# EasyEDA Pro project 3轴6.1--esp32 -(0802).eprj, schematic 原理图
Board Name: esp32; Create Date: 2025-05-14; Page Name: 电源; Project Name: 3轴6.1--esp32 -(0802); Schematic Name: 原理图; Update Date: 2025-08-28; Company: 嘉立创EDA; Page Size: A3; Version: V1.0
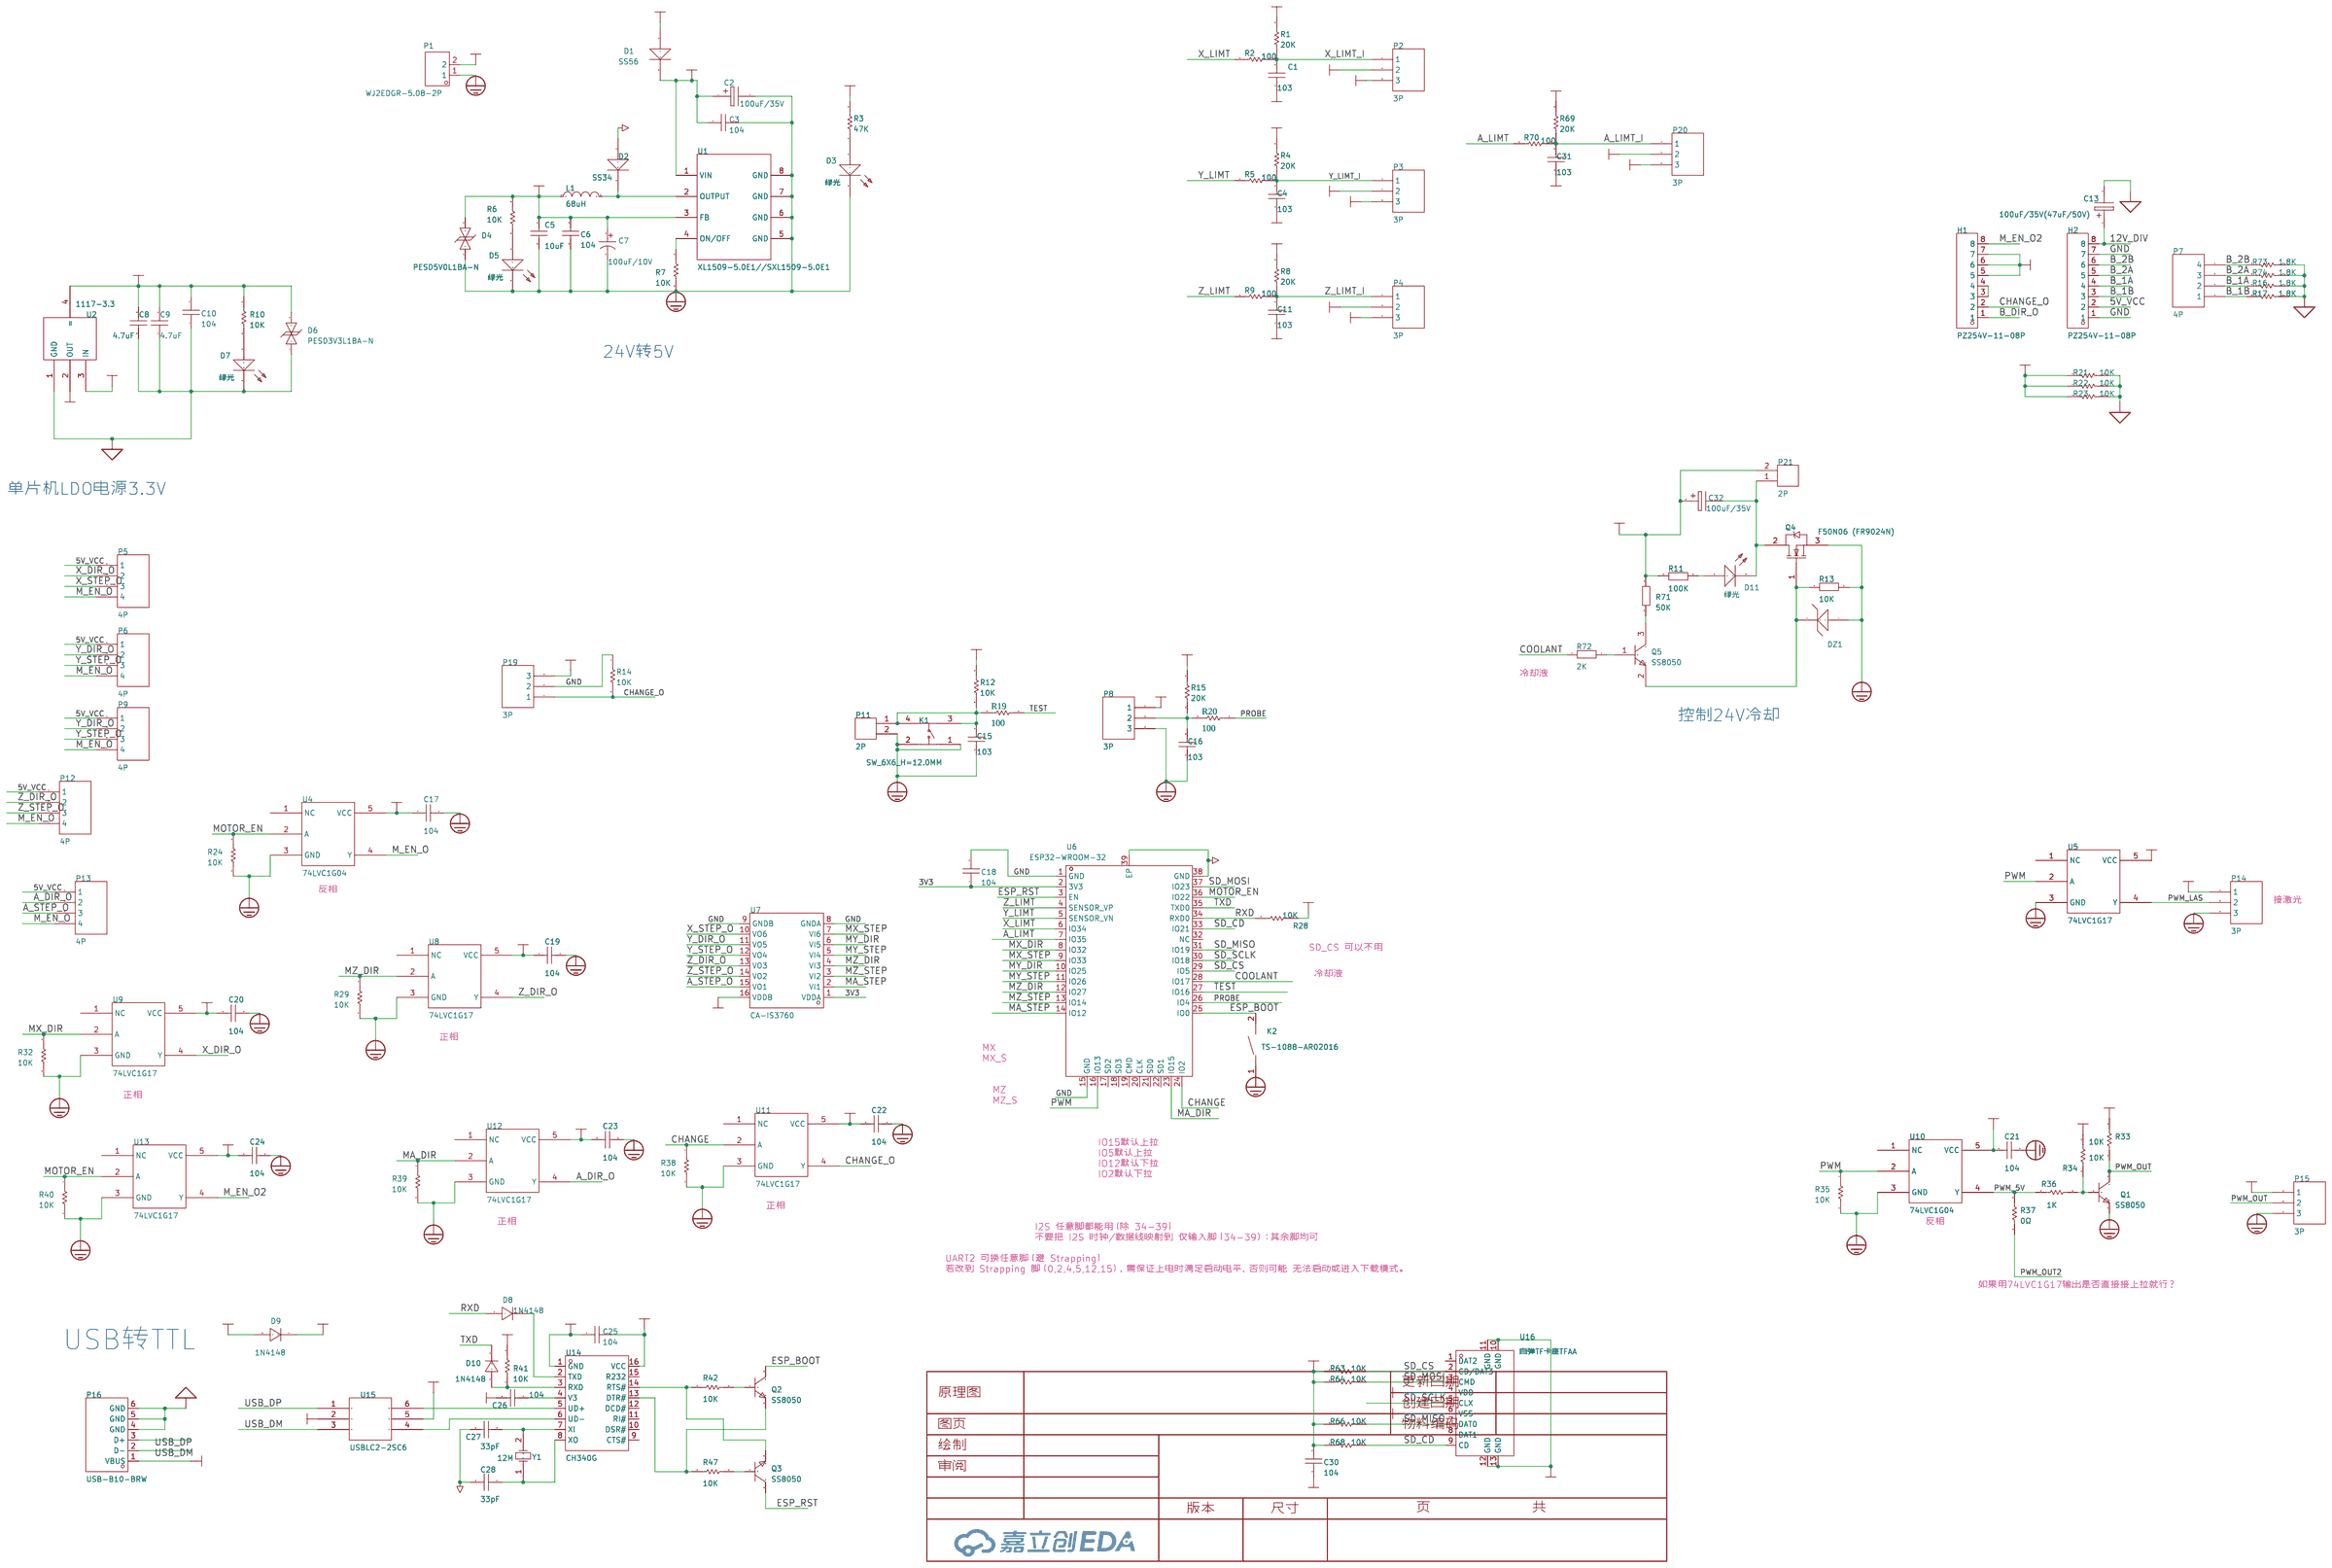
[diagram p0: schematic sheet]

## Parts
C1  103  [11]
C2  100uF/35V  [电解电容贴片6X6]
C3  104  [0603C]
C4  103  [11]
C5  10uF  [C1206]
C6  104  [0603C]
C7  100uF/10V  [CAP-SMD_BD5.0-L5.3-W5.3-RD]
C8  4.7uF  [C1206]
C9  4.7uF  [C1206]
C10  104  [0603C]
C11  103  [11]
C13  100uF/35V(47uF/50V)  [电解电容贴片6X6]
C15  103  [11]
C16  103  [11]
C17  104  [0603C]
C18  104  [0603C]
C19  104  [0603C]
C20  104  [0603C]
C21  104  [0603C]
C22  104  [0603C]
C23  104  [0603C]
C24  104  [0603C]
C25  104  [0603C]
C26  104  [0603C]
C27  18pF  [0603C]
C28  18pF  [0603C]
C30  104  [11]
C31  103  [11]
C32  100uF/35V  [电解电容贴片6X6]
D1  SS56  [SMA]
D2  SS34  [SMA]
D3  绿光  [0603LED]
D4  PESD5V0L1BA-N  [SOD-323_L1.8-W1.3-LS2.5-BI]
D5  绿光  [0603LED]
D6  PESD3V3L1BA-N  [SOD-323_L1.8-W1.3-LS2.5-BI]
D7  绿光  [0603LED]
D8  1N4148  [SOD-123_L2.8-W1.8-LS3.7-RD]
D9  1N4148  [SOD-123_L2.8-W1.8-LS3.7-RD]
D10  1N4148  [SOD-123_L2.8-W1.8-LS3.7-RD]
D11  绿光  [0603LED]
DZ1  --ѹ------SMAZ10V  [SMA]
H1  PZ254V-11-08P  [HDR-TH_8P-P2.54-V-M]
H2  PZ254V-11-08P  [HDR-TH_8P-P2.54-V-M]
K1  SW_6X6_H=12.0MM  [KEY-SMD_4P-L6.0-W6.0-P4.50-LS9.0]
K2  TS-1088-AR02016  [SW-SMD_L3.9-W3.0-P4.45]
L1  68uH  [IND-SMD_L7.0-W7.0_SMDRI74-330MT]
P1  WJ2EDGR-5.08-2P  [CONN-TH_WJ2EDGR-5.08-2P]
P2  3P  [HDR1X3_CON]
P3  3P  [HDR1X3_CON]
P4  3P  [HDR1X3_CON]
P5  4P  [HDR1X4_CON]
P6  4P  [HDR1X4_CON]
P7  4P  [HDR1X4_CON]
P8  3P  [HDR1X3_CON]
P9  4P  [HDR1X4_CON]
P11  2P  [HDR1X2_CON]
P12  4P  [HDR1X4_CON]
P13  4P  [HDR1X4_CON]
P14  3P  [HDR1X3_CON]
P15  3P  [HDR1X3_CON]
P16  USB-B10-BRW  [USB-B-TH_USB-B10-BRW]
P19  3P  [HDR1X3_CON]
P20  3P  [HDR1X3_CON]
P21  2P  [HDR1X2_CON]
Q1  SS8050  [SOT-23-3_L2.9-W1.3-P1.90-LS2.4-BR]
Q2  SS8050  [SOT-23-3_L2.9-W1.3-P1.90-LS2.4-BR]
Q3  SS8050  [SOT-23-3_L2.9-W1.3-P1.90-LS2.4-BR]
Q4  F50N06 (FR9024N)  [TO-252]
Q5  SS8050  [SOT-23]
R1  20K  [10]
R2  100  [10]
R3  47K  [0603R]
R4  20K  [10]
R5  100  [10]
R6  10K  [0603R]
R7  10K  [0603R]
R8  20K  [10]
R9  100  [10]
R10  10K  [0603R]
R11  100K  [0603R]
R12  10K  [0603R]
R13  10K  [0603R]
R14  10K  [0603R]
R15  10K  [0603R]
R16  10K  [0603R]
R17  10K  [0603R]
R19  100  [0603R]
R20  100  [0603R]
R21  10K  [0603R]
R22  10K  [0603R]
R23  10K  [0603R]
R24  10K  [0603R]
R28  10K  [0603R]
R29  10K  [0603R]
R32  10K  [0603R]
R33  10K  [0603R]
R34  10K  [0603R]
R35  10K  [0603R]
R36  1K  [0603R]
R37  0Ω  [0603R]
R38  10K  [0603R]
R39  10K  [0603R]
R40  10K  [0603R]
R41  10K  [0603R]
R42  10K  [0603R]
R47  10K  [0603R]
R63  10K  [10]
R64  10K  [10]
R66  10K  [10]
R68  10K  [10]
R69  20K  [10]
R70  100  [10]
R71  50K  [0603R]
R72  2K  [0603R]
R73  10K  [0603R]
R74  10K  [0603R]
U1  XL1509-5.0E1//SXL1509-5.0E1  [ESOP-8_L4.9-W3.9-P1.27-LS6.0-BL-EP]
U2  1117-3.3  [SOT-223]
U4  74LVC1G04  [SOT-23-5]
U5  74LVC1G17  [SOT-23-5]
U6  ESP32-WROOM-32  [WIFI-SMD_ESP32-WROOM-32UE-A]
U7  CA-IS3760  [SOIC-16_L9.9-W3.9-P1.27-LS6.0-BL]
U8  74LVC1G17  [SOT-23-5]
U9  74LVC1G17  [SOT-23-5]
U10  74LVC1G04  [SOT-23-5]
U11  74LVC1G17  [SOT-23-5]
U12  74LVC1G17  [SOT-23-5]
U13  74LVC1G17  [SOT-23-5]
U14  CH340G  [SOIC-16_L9.9-W3.9-P1.27-LS6.0-BL]
U15  USBLC2-2SC6  [SOT-23-6]
U16  自弹TF卡座TFAA  [SIM-SMD_C9900015645]
Y1  12M  [晶振贴片49SSMD]

## Library data of the parts
C1 C4 C11 C15 C16 C31 = 103: Design Item ID: CAP; Library Name: SCH封装库
C2 C13 C32 = 100uF/35V: Origin Footprint 2: X47U; Origin Footprint 1: 电解电容贴片6x6; Design Item ID: ELECTRO1; Library Name: *
C3 C6 C10 C17-C24 = 104: Capacitor (Semiconductor SIM Model); Published: 8-Jun-2000; LatestRevisionDate: 17-Jul-2002; LatestRevisionNote: Re-released for DXP Platform.; PackageReference: C1206; Publisher: Altium Limited; Origin Footprint 2: C1206; Origin Footprint 3: 0402; Origin Footprint 4: 1310[0504]; Origin Footprint 5: 1608[0603]; Origin Footprint 6: C1210; Origin Footprint 7: C0805; Origin Footprint 8: C1206; Origin Footprint 9: 0805; Origin Footprint 10: 0805L; Design Item ID: Cap Semi; Library Name: Miscellaneous Devices
C5 C8 C9 = 104: Design Item ID: CAP; Library Name: SCH--װ--
C7 = CS1A101M-CRD54: 容值:100uF;精度:±20%;额定电压:10V;电容体直径:5mm;电容体长度:5.4mm;纹波电流:-;等效串联电阻:-;工作寿命:1000hrs@105℃;工作温度:-40℃~+105℃;; LCSC Part Name: 100uF ±20% 10V; Supplier Part: C96182; Manufacturer: ST(先科); Supplier Footprint: SMD,5x5.4mm; JLCPCB Part Class: Extended Part; Datasheet: https://atta.szlcsc.com/upload/public/pdf/source/20170304/1488621207726.pdf; Supplier: LCSC; Tolerance: ±20%; Rated Voltage: 10V; φD: 5mm; L: 5.4mm; Lifetime @ Temp: 1000hrs@105℃; Operating Temperature: -40℃~+105℃
C25 = 103: Capacitor (Semiconductor SIM Model); Published: 8-Jun-2000; LatestRevisionDate: 17-Jul-2002; LatestRevisionNote: Re-released for DXP Platform.; PackageReference: C1206; Publisher: Altium Limited; Origin Footprint 2: C1206; Origin Footprint 3: 0402; Origin Footprint 4: 1310[0504]; Origin Footprint 5: 1608[0603]; Origin Footprint 6: C1210; Origin Footprint 7: C0805; Origin Footprint 8: C1206; Origin Footprint 9: 0805; Origin Footprint 10: 0805L; Design Item ID: Cap Semi; Library Name: Miscellaneous Devices
C26 = 104: Capacitor (Semiconductor SIM Model); Published: 8-Jun-2000; LatestRevisionDate: 17-Jul-2002; LatestRevisionNote: Re-released for DXP Platform.; PackageReference: C1206; Publisher: Altium Limited; Origin Footprint 2: C1206; Origin Footprint 3: 0402; Origin Footprint 4: 1310[0504]; Origin Footprint 5: 1608[0603]; Origin Footprint 6: C1210; Origin Footprint 7: C0805; Origin Footprint 8: C1206; Origin Footprint 9: 0805; Origin Footprint 10: 0805L; Origin Footprint 11: 0805C; Design Item ID: Cap Semi; Library Name: Miscellaneous Devices
C27 C28 = 33pF: Capacitor (Semiconductor SIM Model); Published: 8-Jun-2000; LatestRevisionDate: 17-Jul-2002; LatestRevisionNote: Re-released for DXP Platform.; PackageReference: C1206; Publisher: Altium Limited; Origin Footprint 2: C1206; Origin Footprint 3: 0402; Origin Footprint 4: 1310[0504]; Origin Footprint 5: 1608[0603]; Origin Footprint 6: C1210; Origin Footprint 7: C0805; Origin Footprint 8: C1206; Origin Footprint 9: 0805; Origin Footprint 10: 0805L; Design Item ID: Cap Semi; Library Name: Miscellaneous Devices
C30 = 104: Capacitor (Semiconductor SIM Model); Published: 8-Jun-2000; LatestRevisionDate: 17-Jul-2002; LatestRevisionNote: Re-released for DXP Platform.; PackageReference: C1206; Publisher: Altium Limited; Origin Footprint 2: C1206; Origin Footprint 3: 0402; Origin Footprint 4: 1310[0504]; Origin Footprint 5: 1608[0603]; Origin Footprint 6: C1210; Origin Footprint 7: C0805; Origin Footprint 8: C1206; Origin Footprint 9: 0805; Origin Footprint 10: 0805L; Origin Footprint 11: 0805C; Origin Footprint 1: 0603C; Design Item ID: Cap Semi; Library Name: Miscellaneous Devices
D1 = SS56: Design Item ID: 1N4148; Library Name: SCH封装库
D2 = SS56: Design Item ID: 1N4148; Library Name: SCH--װ--
D3 D5 D7 D11 = 绿光: Origin Footprint 2: LED(小); Design Item ID: LED; Library Name: SCH封装库
D4 D6 = PESD5V0S1BBN: 极性:Bidirectional;反向关断电压（典型值）:5V (Max);击穿电压（最小值）:6V;箝位电压:15V;峰值脉冲电流（10/1000us）:5A (8/20us);; Supplier Part: C314264; Manufacturer: BORN伯恩半导体; Supplier Footprint: SOD-523; JLCPCB Part Class: Extended Part; Datasheet: https://atta.szlcsc.com/upload/public/pdf/source/20181015/C314264_F9AC5761AC2631DA841FBD1D9C6821E3.pdf; Supplier: LCSC; Polarity: Bidirectional; Voltage - Reverse Standoff (Typ): 5V (Max); Voltage - Breakdown (Min): 6V; Voltage - Clamping (Max) @ Ipp: 15V; Current - Peak Pulse (10/1000μs): 5A (8/20us)
D8-D10 = 1N4148W-TP: LCSC Part Name: 100V 150mA 4ns; Supplier Part: C77978; Manufacturer: MCC(美微科); Supplier Footprint: SOD-123; JLCPCB Part Class: Extended Part; Datasheet: https://atta.szlcsc.com/upload/public/pdf/source/20161112/1478931639357.pdf; Supplier: LCSC; Power Dissipation: 400mW; Reverse Voltage (Vr): 100V; Average Rectified Current (Io): 150mA; Forward Voltage (Vf@If): 1.25V@150mA; Reverse Leakage Current: 1μA@75V; Reverse Recovery Time (trr): 4ns; Operating Temperature: -65℃~+150℃@(Tj)
DZ1 = ��ѹ������SMAZ10V: Design Item ID: --ѹ------; Library Name: SCH--װ--
H1 H2 = PZ254V-11-08P: LCSC Part Name: 间距:2.54mm 1x8P 直插 方针; Supplier Part: C492407; Manufacturer: XFCN(兴飞); Supplier Footprint: 插件,P=2.54mm; JLCPCB Part Class: 扩展库; Datasheet: https://atta.szlcsc.com/upload/public/pdf/source/20200309/C492407_83A6FB26A2233368EDB9516968EC6149.pdf; Supplier: LCSC; Pin Structure: 1x8P; Pitch: 2.54mm; Circluar Pins/Square Pins: 方针; Mounting Type: 直插; Number of Rows: 单排; Number of Pins: 8P; Length of Mating Pin: 6mm; Insulation Height: 2.5mm; Length of End Connection Pin: 3mm; Contact Material: 黄铜; Operating Temperature Range: -40℃~+105℃; Color: 黑色
K1 = SW_6X6_H=12.0MM: Supplier Part: C9900018802; Supplier Footprint: KEY-SMD; JLCPCB Part Class: 扩展库; Supplier: LCSC
K2 = TS-1088-AR02016: LCSC Part Name: 4*3*2mm 立贴 轻触开关; Supplier Part: C720477; Manufacturer: XUNPU(讯普); Supplier Footprint: SMD; JLCPCB Part Class: 基础库; Datasheet: https://atta.szlcsc.com/upload/public/pdf/source/20200810/C720475_60D09DD6C54279ADDB2DC25100F1CC11.pdf; Supplier: LCSC; Circuit: 单刀单掷; Actuator Style: 圆形按钮; Operating Force: 160gf; Mounting Style: 立贴; Switch Length: 4mm; Switch Width: 3mm; Switch Height: 2mm; Strike Gundam: 不带; Contact Current: 50mA; Voltage Rating (DC): 12V; Insulation Resistance: 100MΩ; Actuator/Cap Color: 黑色; Pin Style: SMD接片; Mechanical Life: 10万次; Operating Temperature: -30℃~+80℃
L1 = SMDRI74-330MT: 电感值:33uH;精度:±20%;额定电流:960mA;饱和电流(Isat):1.8A;类型:屏蔽电感;; LCSC Part Name: 33uH±20%1.8A; Supplier Part: C49625; Manufacturer: SXN(顺翔诺); Supplier Footprint: SMD,7.5x7.5mm; JLCPCB Part Class: 扩展库; Datasheet: https://atta.szlcsc.com/upload/public/pdf/source/20210810/6F96FDC19AA308DD2AD166FFB9640E87.pdf; Supplier: LCSC; Tolerance: ±20%; Rated Current: 960mA; Saturation Current (Isat): 1.8A; DC Resistance (DCR): 170mΩ; Type: 屏蔽电感
P1 = WJ2EDGR-5.08-2P: LCSC Part Name: 插针/板端 弯针 2P 5.08mm; Supplier Part: C8383; Manufacturer: KANGNEX(康奈克斯电气); Supplier Footprint: P=5.08mm; JLCPCB Part Class: Extended Part; Datasheet: https://atta.szlcsc.com/upload/public/pdf/source/20191225/C8383_DE80ABD4B75356B45B295FA186A21D08.pdf; Supplier: LCSC; Number of PINs Per Row: 2; Mounting Sytle: 弯针; Number of Rows: 1; Pitch: 5.08mm; Connector Type: 板端/插座-开口
P2-P4 P8 P14 P15 P19 P20 = 3P: Library Name: SCH封装库
P5-P7 P9 P12 P13 = 4P: Library Name: SCH封装库
P11 P21 = 2P: Library Name: SCH--װ--
P16 = USB-B10-BRW: 连接器类型:Type-B;标准:USB 2.0;公母:母;端口数量:1;触点数量:4P;安装方式:弯插;额定电流 - 电源:1.5A;工作温度范围:-20℃~+70℃;焊接温度(最大值):260℃;; LCSC Part Name: Type-B母弯插; Supplier Part: C720549; Manufacturer: XUNPU(讯普); Supplier Footprint: 插件; JLCPCB Part Class: 扩展库; Datasheet: https://atta.szlcsc.com/upload/public/pdf/source/20200812/C720549_53E9294752E2933874870440E626C579.pdf; Supplier: LCSC; Connector Type: Type-B; Standard: USB2.0; Gender: 母; Number of Ports: 1; Number of Contacts: 4P; Mounting Style: 弯插; Current Rating - Power (Max): 1.5A; Operating Temperature Range: -20℃~+70℃; Soldering Temperature(Max): 260℃
Q1 = SS8050: 晶体管类型:NPN;集射极击穿电压(Vceo):25V;集电极电流(Ic):1.5A;功率(Pd):300mW;集电极-发射极饱和电压(VCE(sat)@Ic,Ib):500mV@800mA,80mA;直流电流增益(hFE@Ic,Vce):200@100mA,1V;特征频率(fT):100MHz;工作温度:+150℃@(Tj);; LCSC Part Name: SS8050 Y1 200-350 Y1 200-350; Supplier Part: C2150; Manufacturer: CJ（江苏长电/长晶）; Supplier Footprint: SOT-23(SOT-23-3); JLCPCB Part Class: Basic Part; Datasheet: https://atta.szlcsc.com/upload/public/pdf/source/20140809/1457707209319.pdf; Supplier: LCSC; Transistor Type: NPN; Collector-Emitter Breakdown Voltage (Vceo): 25V; Collector Current (Ic): 1.5A; Power Dissipation (Pd): 300mW; Collector-Emitter Saturation Voltage (VCE(sat)@Ic,Ib): 500mV@800mA,80mA; DC Current Gain (hFE@Ic,Vce): 200@100mA,1V; Transition Frequency (fT): 100MHz; Operating Temperature: +150℃@(Tj)
Q2 Q3 = SS8050: LCSC Part Name: NPN 25V 1.5A 120-400 SOT-23; Supplier Part: C2931717; Manufacturer: Doeshare(德芯); Supplier Footprint: SOT-23; JLCPCB Part Class: 扩展库; Datasheet: https://atta.szlcsc.com/upload/public/pdf/source/20220106/99F9A3DFCBDD91265C711555CE6390BF.pdf; Supplier: LCSC
Q4 = F50N06 (FR9024N): N-Channel Power MOSFET; Published: 8-Jun-2000; LatestRevisionDate: 17-Jul-2002; LatestRevisionNote: Re-released for DXP Platform.; DatasheetVersion: PD-9.814; PackageVersion: Feb-1997; PackageReference: TO-220AB; Publisher: Altium Limited; PackageDescription: TO, Thru-Hole, Vertical, Heatsink Mounted; 3 In-Line Leads; Pitch 2.54 mm; Note: Pin 2 is electrically connected to pin 4.; ComponentLink1Description: Manufacturer Link; ComponentLink1URL: http://www.irf.com/; Design Item ID: NMOS-2; Library Name: Miscellaneous Devices
Q5 = SS8050: NPN General Purpose Amplifier; Published: 8-Jun-2000; LatestRevisionDate: 15-Jan-2003; LatestRevisionNote: PCB Footprint &apos;BCY-W3/D4.7&apos; replaced; DatasheetVersion: 1997; PackageVersion: Sep-1998; PackageReference: TO-92A; Publisher: Altium Limited; PackageDescription: TO, Flat Index; 3 In-Line, Axial Leads; Body Dia. 4.5mm; Leads 0.51 x 0.48 mm (max); ComponentLink1Description: Manufacturer Link; ComponentLink1URL: http://www.fairchildsemi.com/; ComponentLink2Description: Datasheet; ComponentLink2URL: http://www.fairchildsemi.com/ds/2N%2F2N3904.pdf; Origin Footprint 2: TO-92A; Design Item ID: 2N3904; Library Name: Miscellaneous Devices; Check: true
R1 R4 R8 R63 R64 R66 R68 R69 = 10K: Resistor; Published: 8-Jun-2000; LatestRevisionDate: 17-Jul-2002; LatestRevisionNote: Re-released for DXP Platform.; PackageReference: AXIAL-0.3; Publisher: Altium Limited; Origin Footprint 2: AXIAL-0.3; Origin Footprint 3: R0805; Origin Footprint 4: 0805R; Origin Footprint 1: 0603R; Design Item ID: RES; Library Name: SCH封装库
R2 R5 R9 R70 = 100: Resistor; Published: 8-Jun-2000; LatestRevisionDate: 17-Jul-2002; LatestRevisionNote: Re-released for DXP Platform.; PackageReference: AXIAL-0.3; Publisher: Altium Limited; Origin Footprint 2: AXIAL-0.3; Origin Footprint 3: R0805; Origin Footprint 4: 0805R; Origin Footprint 1: 0603R; Design Item ID: RES; Library Name: SCH封装库
R3 = 1K: Resistor; Published: 8-Jun-2000; LatestRevisionDate: 17-Jul-2002; LatestRevisionNote: Re-released for DXP Platform.; PackageReference: AXIAL-0.3; Publisher: Altium Limited; Origin Footprint 2: AXIAL-0.3; Origin Footprint 3: R0805; Origin Footprint 4: 0805R; Design Item ID: RES; Library Name: SCH封装库
R6 R10 R12 R14 R15 R28 R41 R42 R47 = 10K: Resistor; Published: 8-Jun-2000; LatestRevisionDate: 17-Jul-2002; LatestRevisionNote: Re-released for DXP Platform.; PackageReference: AXIAL-0.3; Publisher: Altium Limited; Origin Footprint 2: AXIAL-0.3; Origin Footprint 3: R0805; Origin Footprint 4: 0805R; Design Item ID: RES; Library Name: SCH封装库
R7 = 10k: Resistor; Published: 8-Jun-2000; LatestRevisionDate: 17-Jul-2002; LatestRevisionNote: Re-released for DXP Platform.; PackageReference: AXIAL-0.3; Publisher: Altium Limited; Origin Footprint 2: AXIAL-0.3; Origin Footprint 3: R0805; Origin Footprint 4: 0805R; Design Item ID: RES; Library Name: SCH封装库
R11 R13 R72 = 10K: Origin Footprint 2: res; Origin Footprint 3: RES2; Origin Footprint 4: AXIAL-0.4; Origin Footprint 5: 0805R; Design Item ID: res; Library Name: MYLIB
R16 R17 R21-R24 R29 R32-R35 R38-R40 R73 R74 = 10K: Resistor; Published: 8-Jun-2000; LatestRevisionDate: 17-Jul-2002; LatestRevisionNote: Re-released for DXP Platform.; PackageReference: AXIAL-0.3; Publisher: Altium Limited; Origin Footprint 2: AXIAL-0.3; Origin Footprint 3: R0805; Origin Footprint 4: 0805R; Design Item ID: RES; Library Name: SCH--װ--
R19 R20 R36 R37 = 100: Resistor; Published: 8-Jun-2000; LatestRevisionDate: 17-Jul-2002; LatestRevisionNote: Re-released for DXP Platform.; PackageReference: AXIAL-0.3; Publisher: Altium Limited; Origin Footprint 2: AXIAL-0.3; Origin Footprint 3: R0805; Origin Footprint 4: 0805R; Design Item ID: RES; Library Name: SCH--װ--
R71 = 5.1K: Origin Footprint 2: res; Origin Footprint 3: RES2; Origin Footprint 4: AXIAL-0.4; Origin Footprint 5: 0805R; Design Item ID: res; Library Name: MYLIB
U1 = XL1509-5.0E1: 功能类型:降压型;同步整流:-;输出通道数:-;拓扑结构:-;输入电压:-;输出电流(最大值):-;开关频率:-;; LCSC Part Name: 降压型; Supplier Part: C61063; Manufacturer: XLSEMI(芯龙); Supplier Footprint: SOP-8_150mil; JLCPCB Part Class: Basic Part; Datasheet: https://atta.szlcsc.com/upload/public/pdf/source/20151020/1457707483545.pdf; Supplier: LCSC; Function: 降压型
U2 = 1117-3.3: Design Item ID: LM1117; Library Name: Party600
U4 U10 = 74LVC1G04: Design Item ID: 74LVC1G17; Library Name: SCH--װ--
U5 U8 U9 U11-U13 = 74LVC1G04: Library Name: SCH--װ--
U6 = ESP32-WROOM-32: Supplier Part: C95209; Manufacturer: ESPRESSIF(乐鑫); JLCPCB Part Class: 扩展库; Datasheet: https://atta.szlcsc.com/upload/public/pdf/source/20170925/C95209_1506321763821990573.pdf; Supplier: LCSC
U7 = CA-IS3760HN: LCSC Part Name: CA‐IS376x 高速六通道数字隔离器; Supplier Part: C19723481; Manufacturer: Chipanalog(川土微); Supplier Footprint: SOIC-16-NB; JLCPCB Part Class: 扩展库; Datasheet: https://atta.szlcsc.com/upload/public/pdf/source/20231222/0EEB57886E3672BACB4CFC71CD69856C.pdf; Supplier: LCSC
U14 = CH340G: 应用功能:收发器;接口协议:USB 2.0;数据速率:2Mbps;; LCSC Part Name: USB转串口芯片 CH340; Supplier Part: C14267; Manufacturer: WCH(南京沁恒); Supplier Footprint: SOP-16; JLCPCB Part Class: 扩展库; Datasheet: https://atta.szlcsc.com/upload/public/pdf/source/20230530/6E401E9554E9F5311886CC8B3F89B62E.pdf; Supplier: LCSC; Applications Function: 收发器; Protocol: USB 2.0; Supply Voltage: 3.3V；5V; Data Rate: 2Mbps
U15 = USBLC2-2SC6: Design Item ID: DIP6; Library Name: SCH封装库
U16 = 自弹TF卡座TFAA: Supplier Part: C9900015645; Supplier Footprint: SMD; JLCPCB Part Class: 扩展库; Supplier: LCSC
Y1 = 12M: Crystal Oscillator; Published: 8-Jun-2000; LatestRevisionDate: 17-Jul-2002; LatestRevisionNote: Re-released for DXP Platform.; PackageReference: R38; Publisher: Altium Limited; Origin Footprint 2: R38; Origin Footprint 3: XTAL-49S; Design Item ID: XTAL; Library Name: Miscellaneous Devices

## Nets
3V3: C8.2 C9.2 C10.2 C18.1 C30.2 D6.2 R10.2 R12.1 R28.1 R63.2 R64.2 R66.2 R68.2 U2.2(OUT) U2.4(=) U6.2(3V3) U7.1(VDDA) U16.4(VDD)
5V_VCC: C5.1 C6.2 C7.1 C17.2 C19.2 C20.2 C21.2 C22.2 C23.2 C24.2 C25.1 D4.2 D9.1(c) H1.5 H1.6 H1.7 H2.2 L1.1 P2.3 P3.3 P4.3 P5.1 P6.1 P8.1 P9.1 P12.1 P13.1 P15.1 P19.3 P20.3 R1.2 R4.2 R6.2 R8.2 R15.1 R21.1 R22.1 R23.1 R33.2 R34.2 R41.2 R69.2 U1.3(FB) U2.3(IN) U4.5(VCC) U5.5(VCC) U7.16(VDDB) U8.5(VCC) U9.5(VCC) U10.5(VCC) U11.5(VCC) U12.5(VCC) U13.5(VCC) U14.16(VCC)
12V_DIV: C13.1 H2.8
24V: C32.1 D1.1 P1.2 P14.1 P21.2 R3.2 R11.1 R71.2
GND: C1.1 C2.2 C3.1 C4.1 C5.2 C6.1 C7.2 C8.1 C9.1 C10.1 C11.1 C13.2 C15.1 C16.1 C17.1 C18.2 C19.1 C20.1 C21.1 C22.1 C23.1 C24.1 C25.2 C26.2 C27.2 C28.2 C30.1 C31.1 D2.1 D3.2 D4.1 D5.2 D6.1 D7.2 DZ1.1 H2.1 H2.7 K1.1 K1.2 K2.1 P1.1 P2.2 P3.2 P4.2 P8.3 P11.2 P14.3 P15.3 P16.4(GND) P16.5(GND) P16.6(GND) P19.2 P20.2 Q1.2(E) Q4.3(S) R7.2 R13.1 R14.1 R16.2 R17.2 R21.2 R22.2 R23.2 R24.2 R29.2 R32.2 R35.2 R38.2 R39.2 R40.2 R73.2 R74.2 U1.5(GND) U1.6(GND) U1.7(GND) U1.8(GND) U2.1(GND) U4.3(GND) U5.3(GND) U6.1(GND) U6.15(GND) U6.38(GND) U6.39(EP) U7.8(GNDA) U7.9(GNDB) U8.3(GND) U9.3(GND) U10.3(GND) U11.3(GND) U12.3(GND) U13.3(GND) U14.1(GND) U15.2 U16.6(VSS) U16.10(GND) U16.11(GND) U16.12(GND) U16.13(GND)
VIN_24V: C2.1 C3.2 D1.2 U1.1(VIN)
A_DIR_O: P13.2 U12.4(Y)
A_LIMT: R70.2 U6.7(IO35)
A_LIMT_I: C31.2 P20.1 R69.1 R70.1
A_STEP_O: P13.3 U7.15(VO1)
B_1A: H2.4 P7.2 R16.1
B_1B: H2.3 P7.1 R17.1
B_2A: H2.5 P7.3 R74.1
B_2B: H2.6 P7.4 R73.1
B_DIR_O: H1.1
CHANGE: R38.1 U6.24(IO2) U11.2(A)
CHANGE_O: H1.2 P19.1 R14.2 U11.4(Y)
COOLANT: R72.2 U6.28(IO17)
ESP_BOOT: K2.2 Q2.3(C) U6.25(IO0)
ESP_RST: Q3.3(C) U6.3(EN)
M_EN_O: P5.4 P6.4 P9.4 P12.4 P13.4 U4.4(Y)
M_EN_O2: H1.8 U13.4(Y)
MA_DIR: R39.1 U6.23(IO15) U12.2(A)
MA_STEP: U6.14(IO12) U7.2(VI1)
MOTOR_EN: R24.1 R40.1 U4.2(A) U6.36(IO22) U13.2(A)
MX_DIR: R32.1 U6.8(IO32) U9.2(A)
MX_STEP: U6.9(IO33) U7.7(VI6)
MY_DIR: U6.10(IO25) U7.6(VI5)
MY_STEP: U6.11(IO26) U7.5(VI4)
MZ_DIR: R29.1 U6.12(IO27) U7.4(VI3) U8.2(A)
MZ_STEP: U6.13(IO14) U7.3(VI2)
PROBE: R20.1 U6.26(IO4)
PWM: R35.1 U5.2(A) U6.16(IO13) U10.2(A)
PWM_5V: R36.1 R37.2 U10.4(Y)
PWM_LAS: P14.2 U5.4(Y)
PWM_OUT: P15.2 Q1.3(C) R33.1
PWM_OUT2: R37.1
RXD: D8.2(A) R28.2 U6.34(RXD0)
SD_CD: R68.1 U6.33(IO21) U16.9(CD)
SD_CS: R63.1 U6.29(IO5) U16.2(CD/DAT3)
SD_MISO: R66.1 U6.31(IO19) U16.7(DAT0)
SD_MOSI: R64.1 U6.37(IO23) U16.3(CMD)
SD_SCLK: U6.30(IO18) U16.5(CLX)
TEST: R19.1 U6.27(IO16)
TXD: D10.1(c) U6.35(TXD0)
USB_DM: P16.2(D-) U15.3
USB_DP: P16.3(D+) U15.1
VUSB: D9.2(A) P16.1(VBUS) U15.5
X_DIR_O: P5.2 U9.4(Y)
X_LIMT: R2.2 U6.6(IO34)
X_LIMT_I: C1.2 P2.1 R1.1 R2.1
X_STEP_O: P5.3 U7.10(VO6)
Y_DIR_O: P6.2 P9.2 U7.11(VO5)
Y_LIMT: R5.2 U6.5(SENSOR_VN)
Y_LIMT_I: C4.2 P3.1 R4.1 R5.1
Y_STEP_O: P6.3 P9.3 U7.12(VO4)
Z_DIR_O: P12.2 U7.13(VO3) U8.4(Y)
Z_LIMT: R9.2 U6.4(SENSOR_VP)
Z_LIMT_I: C11.2 P4.1 R8.1 R9.1
Z_STEP_O: P12.3 U7.14(VO2)
$9N72390: D2.2 L1.2 U1.2(OUTPUT)
$9N72392: R7.1 U1.4(ON/OFF)
$9N72730: D3.1 R3.1
$9N85928: C26.1 U14.4(V3)
$9N85949: U14.5(UD+) U15.6
$9N85958: U14.6(UD-) U15.4
$9N85962: C27.1 U14.7(XI) Y1.2(OSC2)
$9N85965: C28.1 U14.8(XO) Y1.1(OSC1)
$9N86544: D8.1(c) U14.2(TXD)
$9N86546: D10.2(A) R41.1 U14.3(RXD)
$9N86982: Q2.2(E) R47.1 U14.13(DTR#)
$9N86987: Q3.2(E) R42.1 U14.14(RTS#)
$9N89334: Q2.1(B) R42.2
$9N89338: Q3.1(B) R47.2
$9N98710: C15.2 K1.3 K1.4 P11.1 R12.2 R19.2
$9N100484: C16.2 P8.2 R15.2 R20.2
$9N100840: D7.1 R10.1
$9N100955: D5.1 R6.1
$9N125401: Q1.1(B) R34.1 R36.2
$9N133119: H1.3 H1.4
Net-(C32-2): C32.2 D11.2 P21.1 Q4.2(D)
Net-(D11-1): D11.1 R11.2
Net-(DZ1-2): DZ1.2 Q4.1(G) Q5.2(E) R13.2
Net-(Q5-1): Q5.1(B) R72.1
Net-(Q5-3): Q5.3(C) R71.1

Not connected (* = marked no-connect by the designer): U4 1(NC); U5 1(NC); U6 17(SD2) 18(SD3) 19(CMD) 20(CLK) 21(SD0) 22(SD1) 32(NC); U8 1(NC); U9 1(NC); U10 1(NC); U11 1(NC); U12 1(NC); U13 1(NC); U14 9(CTS#) 10(DSR#) 11(RI#) 12(DCD#) 15(R232); U16 1(DAT2) 8(DAT1)

## Notes on the sheet
- 24V转5V
- 单片机LDO电源3.3V
- 冷却液
- 控制24V冷却
- 反相
- 接激光
- SD_CS 可以不用
- 冷却液
- 正相
- MX
- MX_S
- 正相
- MZ
- MZ_S
- IO15默认上拉
  IO5默认上拉
  IO12默认下拉
  IO2默认下拉
- 正相
- 正相
- 反相
- I2S 任意脚都能用（除 34-39）
  不要把 I2S 时钟/数据线映射到 仅输入脚（34-39）；其余脚均可
- UART2 可换任意脚（避 Strapping）
  若改到 Strapping 脚（0,2,4,5,12,15），需保证上电时满足启动电平，否则可能 无法启动或进入下载模式。
- 如果用74LVC1G17输出是否直接接上拉就行？
- USB转TTL
